# Altium schematic sheet Sheet_Power.SchDoc: Power scheme
size A4; Organization: Altium Limited; Address1: L3, 12a Rodborough Rd; Address2: Frenchs Forest; Address3: NSW; Address4: Australia 2086
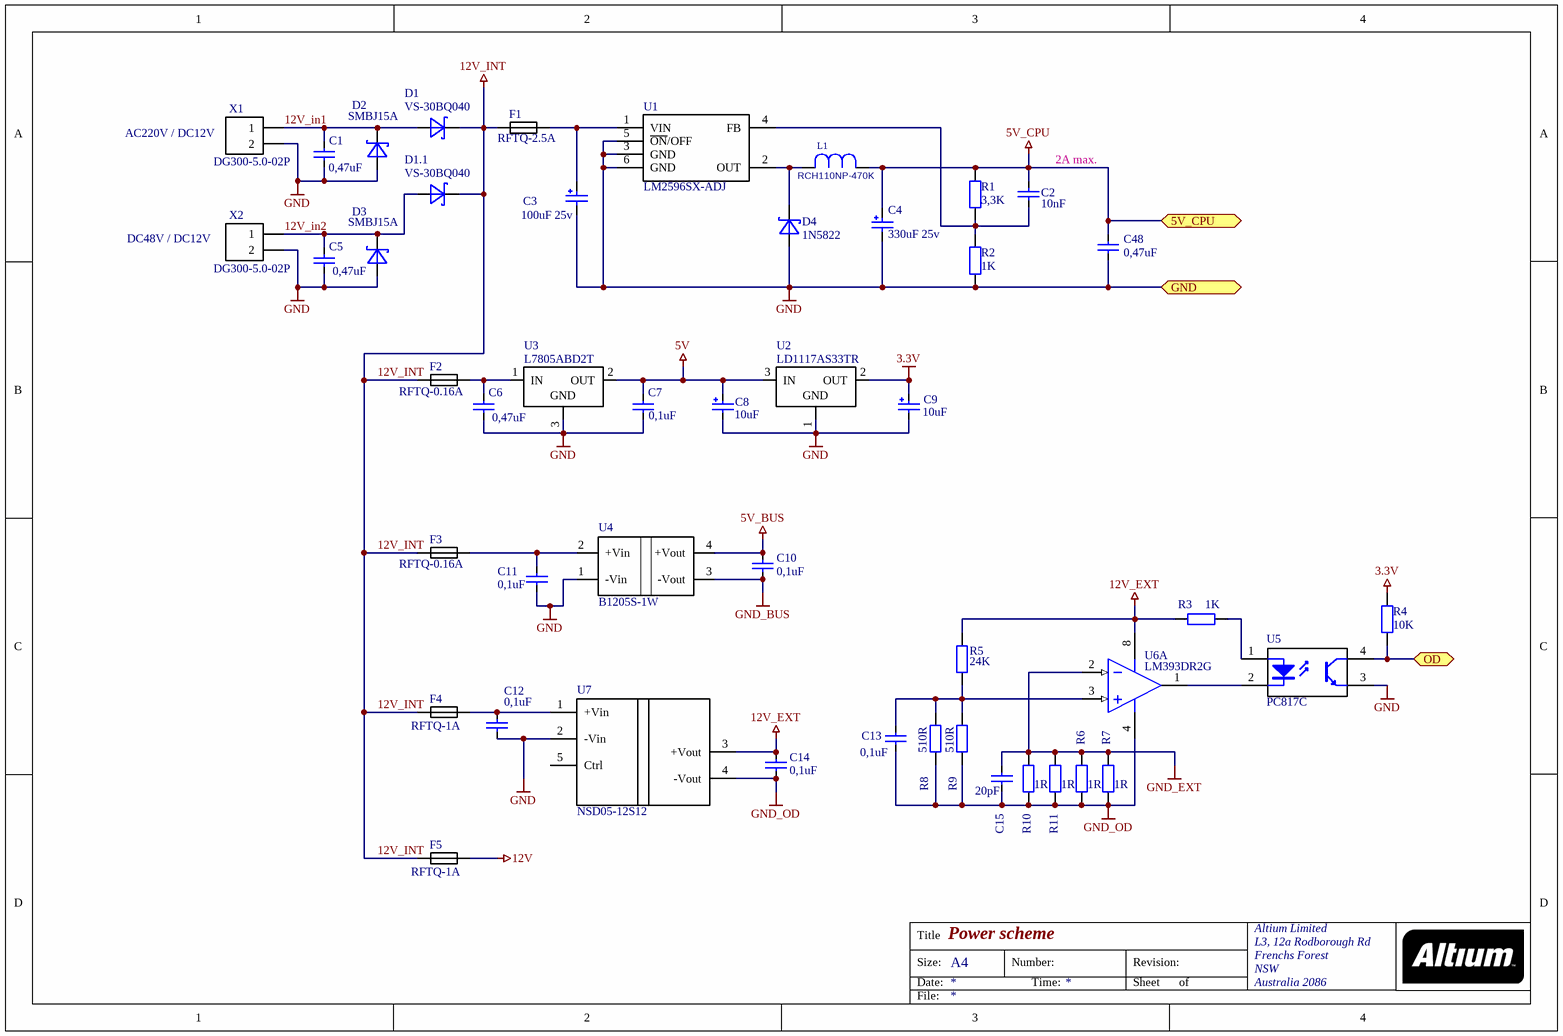
[diagram p0: Sheet_Power.SchDoc]

## Parts
C1  value 0,47uF  [C_1206]  (hidden comment: Cap_Semi)
C2  value 10nF  [C_0805]  (hidden comment: Cap_Semi)
C3  value 100uF 25v  [8x11]  (hidden comment: Cap_Polar)
C4  value 330uF 25v  [10x16]  (hidden comment: Cap_Polar)
C5  value 0,47uF  [C_1206]  (hidden comment: Cap_Semi)
C6  value 0,47uF  [C_1206]  (hidden comment: Cap_Semi)
C7  value 0,1uF  [C_0805]  (hidden comment: Cap_Semi)
C8  value 10uF  [5x11]  (hidden comment: Cap_Polar)
C9  value 10uF  [5x11]  (hidden comment: Cap_Polar)
C10  value 0,1uF  [C_0805]  (hidden comment: Cap_Semi)
C11  value 0,1uF  [C_0805]  (hidden comment: Cap_Semi)
C12  value 0,1uF  [C_0805]  (hidden comment: Cap_Semi)
C13  value 0,1uF  [C_0805]  (hidden comment: Cap_Semi)
C14  value 0,1uF  [C_0805]  (hidden comment: Cap_Semi)
C15  value 20pF  [C_0805]  (hidden comment: Cap_Semi)
C48  value 0,47uF  [C_1206]  (hidden comment: Cap_Semi)
D1  VS-30BQ040  [SMC]
D1.1  VS-30BQ040  [SMC]
D2  SMBJ15A  [SMB]
D3  SMBJ15A  [SMB]
D4  1N5822  [DO-201]
F1  RFTQ-2.5A  [Fuse RFTQ]
F2  RFTQ-0.16A  [Fuse RFTQ]
F3  RFTQ-0.16A  [Fuse RFTQ]
F4  RFTQ-1A  [Fuse RFTQ]
F5  RFTQ-1A  [Fuse RFTQ]
L1  RCH110NP-470K  [RCH-110]
R1  value 3,3K  [R_0805]  (hidden comment: Resistor)
R2  value 1K  [R_0805]  (hidden comment: Resistor)
R3  value 1K  [R_0805]  (hidden comment: Resistor)
R4  value 10K  [R_0805]  (hidden comment: Resistor)
R5  value 24K  [R_0805]  (hidden comment: Resistor)
R6  value 1R  [R_1206]  (hidden comment: Resistor)
R7  value 1R  [R_1206]  (hidden comment: Resistor)
R8  value 510R  [R_0805]  (hidden comment: Resistor)
R9  value 510R  [R_0805]  (hidden comment: Resistor)
R10  value 1R  [R_1206]  (hidden comment: Resistor)
R11  value 1R  [R_1206]  (hidden comment: Resistor)
U1  LM2596SX-ADJ  [D2PAK_5p]
U2  LD1117AS33TR  [SOT-223_N]
U3  L7805ABD2T  [D2PAK_3p]
U4  B1205S-1W  [SIP4]
U5  PC817C  [DIP-4]
U6  LM393DR2G  [SO-8_L]  (part A of 2)
U7  NSD05-12S12  [NSD05]
X1  DG300-5.0-02P  [5mm 2]
X2  DG300-5.0-02P  [5mm 2]

## Ports
5V_CPU, GND, OD

## Nets
3.3V: C9.1 R4.2 U2.2(OUT)
5V: C7.2 C8.1 U2.3(IN) U3.2(OUT)
5V_BUS: C10.1 U4.4(+Vout)
5V_CPU: C2.1 C4.1 C48.2 L1.1 R1.2 ; port 5V_CPU
12V: F5.1
12V_EXT: C14.2 R3.1 R5.2 U6.8(VCC) U7.3(+Vout)
12V_INT: D1.2(C) D1.1.2(C) F1.2 F2.2 F3.2 F4.2 F5.2
GND: C1.1 C3.2 C4.2 C5.1 C6.1 C7.1 C8.2 C9.2 C11.2 C12.1 C48.1 D2.1(A) D3.1(A) D4.1(A) R2.1 U1.3(GND) U1.5(~{ON}/OFF) U1.6(GND) U2.1(GND) U3.3(GND) U4.1(-Vin) U5.3(E) U7.2(-Vin) X1.2 X2.2 ; port GND
GND_BUS: C10.2 U4.3(-Vout)
GND_EXT: C15.2 R6.2 R7.2 R10.2 R11.2 U6.2(INA-)
GND_OD: C13.1 C14.1 C15.1 R6.1 R7.1 R8.1 R9.1 R10.1 R11.1 U6.4(GND) U7.4(-Vout)
12V_in1: C1.2 D1.1(A) D2.2(C) X1.1
12V_in2: C5.2 D1.1.1(A) D3.2(C) X2.1
OD: R4.1 U5.4(C) ; port OD
NetC2_2: C2.2 R1.1 R2.2 U1.4(FB)
NetC3_1: C3.1 F1.1 U1.1(VIN)
NetC6_2: C6.2 F2.1 U3.1(IN)
NetC11_1: C11.1 F3.1 U4.2(+Vin)
NetC12_2: C12.2 F4.1 U7.1(+Vin)
NetC13_2: C13.2 R5.1 R8.2 R9.2 U6.3(INA+)
NetD4_2: D4.2(C) L1.2 U1.2(OUT)
NetR3_2: R3.2 U5.1(A)
NetU5_2: U5.2(K) U6.1(OUTA)

Not connected (* = marked no-connect by the designer): U7 5(Ctrl)

## Notes on the sheet
- (near X1) AC220V / DC12V
- (near C2) 2A max.
- DC48V / DC12V
- Title
- Size:
- Date:
- A4
- Number:
- Time:
- Revision:
- Sheet
- of
- File:

## Library data of the parts
C1 C2 C5-C7 C10-C15 C48 = Cap_Semi: Capacitor semi
C3 C4 = Cap_Polar: Capacitor Polar
C8 C9 = Capacitor Polar
D1 D1.1 = VS-30BQ040: Diode Schottky
D2 D3 = SMBJ13A: Supressor
D4 = 1N5822: Diode Schottky
F1-F5 = Fuse
L1 = Inductor: Value: RCH110NP-470K
U1 = LM2596SX-ADJ: Easy Switcher 3.0A Step-Down Voltage Regulator
U2 = LD1117AS33TR: Voltage Regulators 800mA
U3 = L7805ABD2T: Voltage Regulators
U4 = B0505S-1W: DC/DC converter
U5 = PC817: Optocoupler
U6 = LM393DR2G: Dual Comparators
U7 = NSD05-12S12: DC/DC Regulated Single Output
X1 X2 = DG300_2pin: Connector 5mm